# Altium schematic sheet WIFI.SchDoc
size B
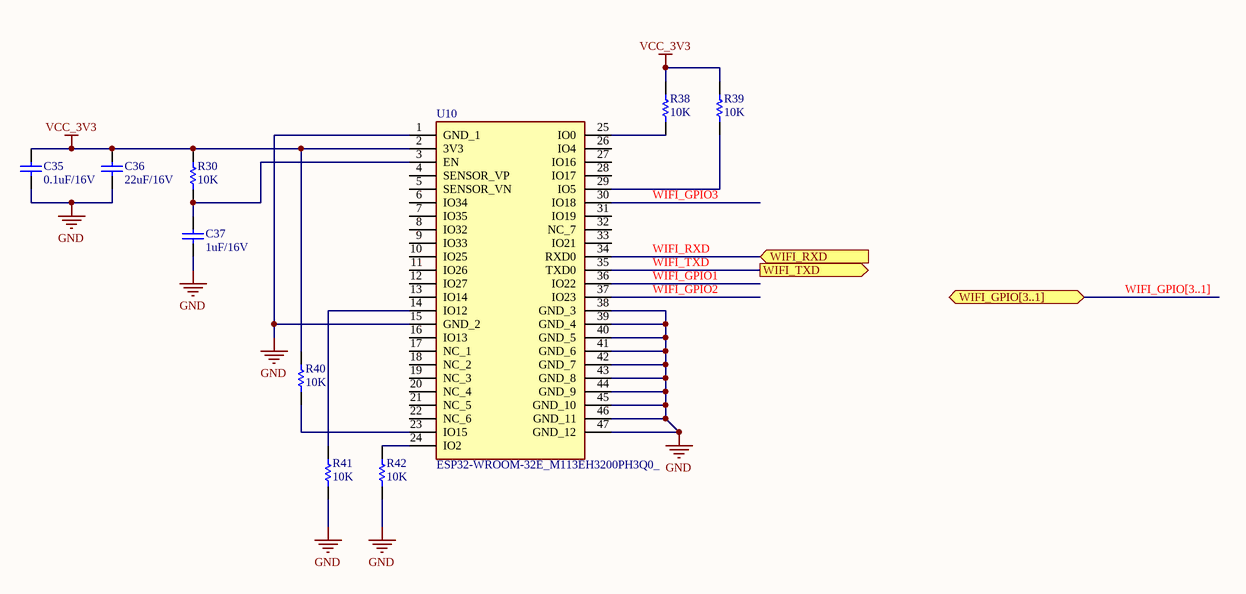
[diagram p0: WIFI.SchDoc]

## Parts
C35  0.1uF/16V  [RAD-0.3]
C36  22uF/16V  [RAD-0.3]
C37  1uF/16V  [RAD-0.3]
R30  10K  [AXIAL-0.3]
R38  10K  [AXIAL-0.3]
R39  10K  [AXIAL-0.3]
R40  10K  [AXIAL-0.3]
R41  10K  [AXIAL-0.3]
R42  10K  [AXIAL-0.3]
U10  ESP32-WROOM-32E_M113EH3200PH3Q0_  [ESP32WROOM32EM113EH3200PH3Q0]

## Ports
WIFI_GPIO[3..1] (bidir), WIFI_RXD (in), WIFI_TXD (out)

## Nets
GND: C35.2 C36.2 C37.2 R41.2 R42.2 U10.1(GND_1) U10.15(GND_2) U10.38(GND_3) U10.39(GND_4) U10.40(GND_5) U10.41(GND_6) U10.42(GND_7) U10.43(GND_8) U10.44(GND_9) U10.45(GND_10) U10.46(GND_11) U10.47(GND_12)
VCC_3V3: C35.1 C36.1 R30.1 R38.1 R39.1 R40.1 U10.2(3V3)
WIFI_GPIO1: U10.36(IO22)
WIFI_GPIO2: U10.37(IO23)
WIFI_GPIO3: U10.30(IO18)
WIFI_RXD: U10.34(RXD0) ; port WIFI_RXD
WIFI_TXD: U10.35(TXD0) ; port WIFI_TXD
NetC37_1: C37.1 R30.2 U10.3(EN)
NetR38_2: R38.2 U10.25(IO0)
NetR39_2: R39.2 U10.29(IO5)
NetR40_2: R40.2 U10.23(IO15)
NetR41_1: R41.1 U10.14(IO12)
NetR42_1: R42.1 U10.24(IO2)

Not connected (* = marked no-connect by the designer): U10 4(SENSOR_VP) 5(SENSOR_VN) 6(IO34) 7(IO35) 8(IO32) 9(IO33) 10(IO25) 11(IO26) 12(IO27) 13(IO14) 16(IO13) 17(NC_1) 18(NC_2) 19(NC_3) 20(NC_4) 21(NC_5) 22(NC_6) 26(IO4) 27(IO16) 28(IO17) 31(IO19) 32(NC_7) 33(IO21)

## Buses and harness runs
bus WIFI_GPIO[3..1] = port WIFI_GPIO[3..1]

## Library data of the parts
C35-C37 = Cap: Capacitor; Published: 8-Jun-2000; LatestRevisionDate: 17-Jul-2002; LatestRevisionNote: Re-released for DXP Platform.; PackageReference: RAD-0.3; Publisher: Altium Limited; PackageDescription: Radial Cap, Thru-Hole; 2 Leads; 0.3 in Pin Spacing
  C35: Value: 0.1uF/16V
  C36: Value: 22uF/16V
  C37: Value: 1uF/16V
R30 R38-R42 = Res1: Resistor; Published: 8-Jun-2000; LatestRevisionDate: 17-Jul-2002; LatestRevisionNote: Re-released for DXP Platform.; PackageReference: AXIAL-0.3; Publisher: Altium Limited; PackageDescription: Axial Device, Thru-Hole; 2 Leads; 0.3 in Pin Spacing; Value: 10K
U10 = ESP32-WROOM-32E_M113EH3200PH3Q0_: Integrated Circuit; Manufacturer_Name: Espressif Systems; Manufacturer_Part_Number: ESP32-WROOM-32E(M113EH3200PH3Q0); Datasheet Link: https://www.mouser.com/datasheet/2/891/esp32-wroom-32e_esp32-wroom-32ue_datasheet_en-1855879.pdf; Height: 3.25mm; Mouser Part Number: 356-ESP32WRM32E132PH; Mouser Price/Stock: https://www.mouser.co.uk/ProductDetail/Espressif-Systems/ESP32-WROOM-32EM113EH3200PH3Q0/?qs=vHuUswq2%252Bsx8Xcp7bzmaHA%3D%3D